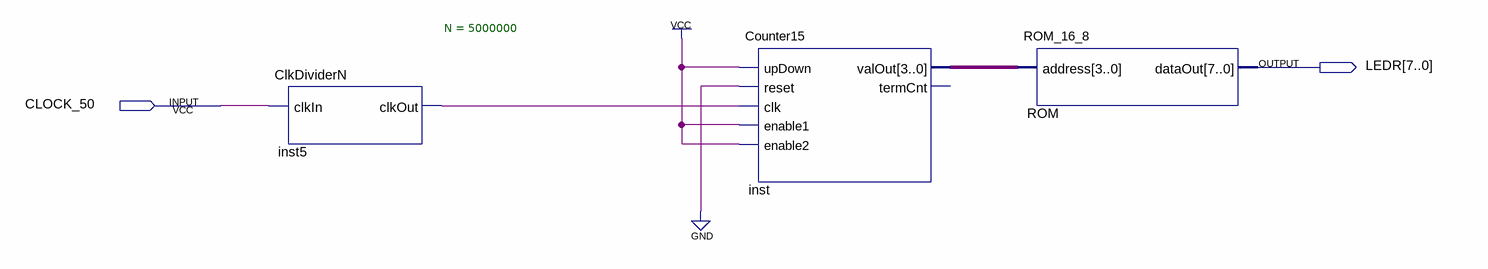
[diagram p0: schematic sheet]
// Quartus schematic ROM_Demo.bdf as structural Verilog: 3 symbols, 2 pins
module ROM_Demo (
  input  CLOCK_50,
  output [7:0] LEDR
);

  wire inst5_clkout;
  wire [3:0] inst_valout;

  ClkDividerN #(.N(5000000)) inst5 (.clkIn(CLOCK_50), .clkOut(inst5_clkout));
  Counter15 inst (
    .upDown(1'b1), .reset(1'b0), .clk(inst5_clkout), .enable1(1'b1), .enable2(1'b1), .valOut(inst_valout));  // open: termCnt
  ROM_16_8 ROM (.address(inst_valout), .dataOut(LEDR));
endmodule
